# EAGLE schematic d725-pwm-dco (EAGLE 7.6.0)
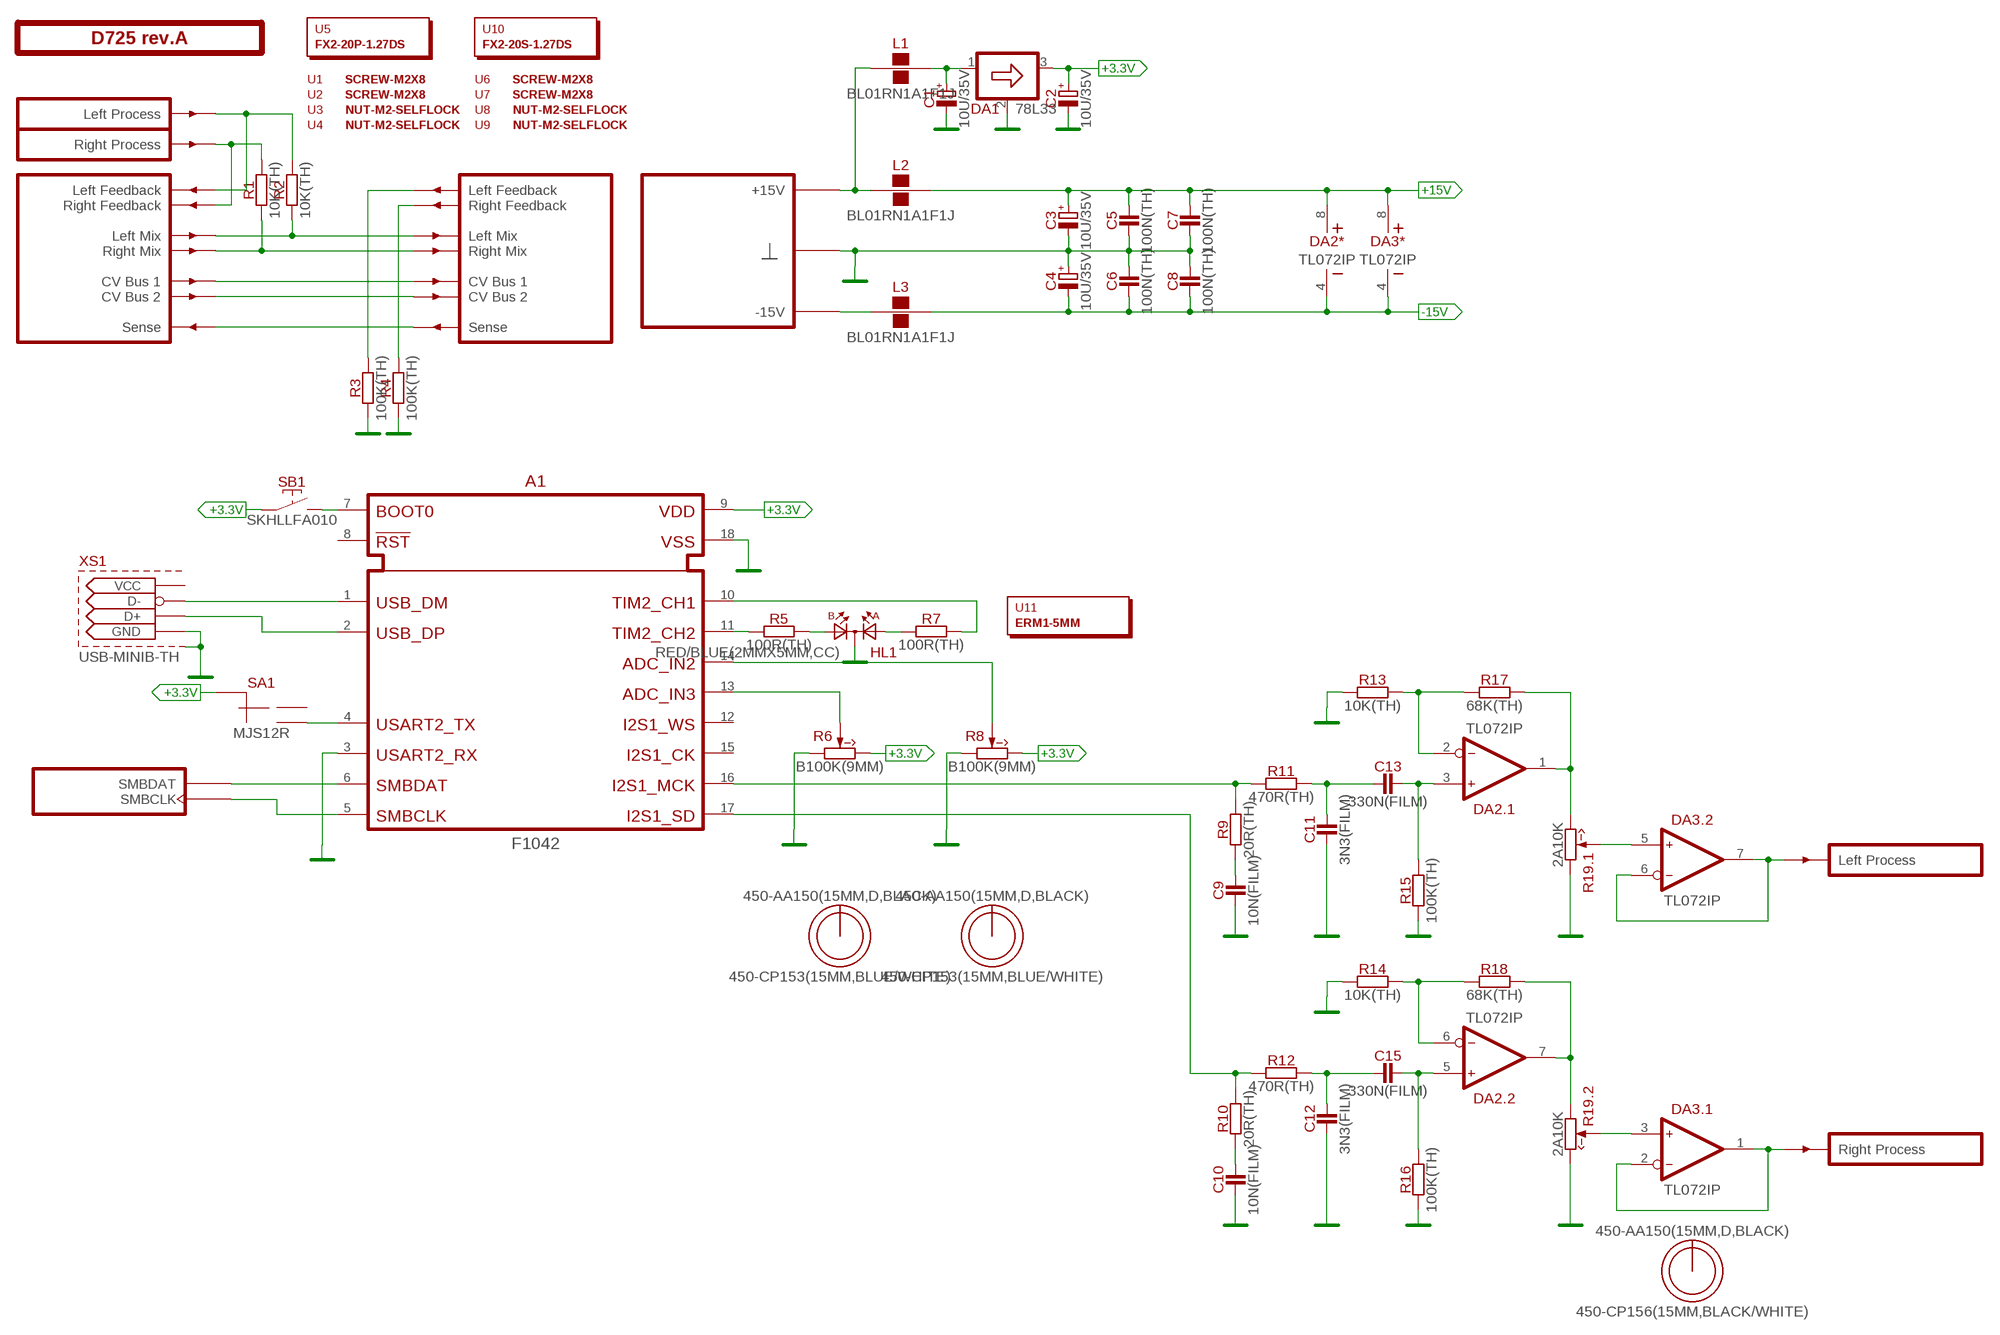
[diagram p0: schematic, sheet 1]

## Parts
A1  F1042  [F-DIP18]
C1  10U/35V  [E2-5]
C2  10U/35V  [E2-5]
C3  10U/35V  [E2-5]
C4  10U/35V  [E2-5]
C5  100N(TH)  [C050-024X044]
C6  100N(TH)  [C050-024X044]
C7  100N(TH)  [C050-024X044]
C8  100N(TH)  [C050-024X044]
C9  10N(FILM)  [C050-025X075]
C10  10N(FILM)  [C050-025X075]
C11  3N3(FILM)  [C050-025X075]
C12  3N3(FILM)  [C050-025X075]
C13  330N(FILM)  [C050-035X075]
C15  330N(FILM)  [C050-035X075]
DA1  78L33  [TO92]
DA2  TL072IP  [DIP-8]
DA3  TL072IP  [DIP-8]
HL1  RED/BLUE(2MMX5MM,CC)  [LED2X5-3PIN]
L1  BL01RN1A1F1J  [BL01RN1A]
L2  BL01RN1A1F1J  [BL01RN1A]
L3  BL01RN1A1F1J  [BL01RN1A]
O1  450-AA150(15MM,D,BLACK)  [EMPTY]
O2  450-CP153(15MM,BLUE/WHITE)  [EMPTY]
O3  450-AA150(15MM,D,BLACK)  [EMPTY]
O4  450-CP153(15MM,BLUE/WHITE)  [EMPTY]
O5  450-AA150(15MM,D,BLACK)  [EMPTY]
O6  450-CP156(15MM,BLACK/WHITE)  [EMPTY]
PCB1  D725 rev.A  ST2-BOARD-50  [ST2-BOARD-50]
R1  10K(TH)  [R-0207/10]
R2  10K(TH)  [R-0207/10]
R3  100K(TH)  [R-0207/10]
R4  100K(TH)  [R-0207/10]
R5  100R(TH)  [R-0207/10]
R6  B100K(9MM)  [RV09-SINGLE]
R7  100R(TH)  [R-0207/10]
R8  B100K(9MM)  [RV09-SINGLE]
R9  20R(TH)  [R-0207/10]
R10  20R(TH)  [R-0207/10]
R11  470R(TH)  [R-0207/10]
R12  470R(TH)  [R-0207/10]
R13  10K(TH)  [R-0207/10]
R14  10K(TH)  [R-0207/10]
R15  100K(TH)  [R-0207/10]
R16  100K(TH)  [R-0207/10]
R17  68K(TH)  [R-0207/10]
R18  68K(TH)  [R-0207/10]
R19  2A10K  [RV11-DUAL]
SA1  MJS12R  [APEM-MJS12R]
SB1  SKHLLFA010  [SKHLLFA010]
U1  SCREW-M2X8  [EMPTY]
U2  SCREW-M2X8  [EMPTY]
U3  NUT-M2-SELFLOCK  [EMPTY]
U4  NUT-M2-SELFLOCK  [EMPTY]
U5  FX2-20P-1.27DS  [EMPTY]
U6  SCREW-M2X8  [EMPTY]
U7  SCREW-M2X8  [EMPTY]
U8  NUT-M2-SELFLOCK  [EMPTY]
U9  NUT-M2-SELFLOCK  [EMPTY]
U10  FX2-20S-1.27DS  [EMPTY]
U11  ERM1-5MM  [EMPTY]
XS1  USB-MINIB-TH  [USB-MB-H]

## Nets
+3.3V: A1.9(VDD) C2.+ DA1.3(OUT) R6.3(CW) R8.3(CW) SA1.C(CM) SB1.1
+15V: C3.+ C5.2 C7.2 DA2.8(*:V+) DA3.8(*:V+) L2.2
-15V: C4.- C6.1 C8.1 DA2.4(*:V-) DA3.4(*:V-) L3.2
GND: A1.3(USART2_RX) A1.18(VSS) C1.- C2.- C3.- C4.+ C5.1 C6.2 C7.1 C8.2 C9.1 C10.1 C11.1 C12.1 DA1.2(GND) HL1.K PCB1.B4'(GND) PCB1.B4(GND) PCB1.B5'(GND) PCB1.B5(GND) PCB1.B6'(GND) PCB1.B6(GND) PCB1.B7'(GND) PCB1.B7(GND) PCB1.B8'(GND) PCB1.B8(GND) R3.1 R4.1 R6.1(CCW) R8.1(CCW) R13.1 R14.1 R15.1 R16.1 R19.1(.1:CCW) R19.3'(.2:CW) XS1.GND XS1.P$1(S1) XS1.P$2(S1) XS1.P$6(S1) XS1.P$7(S1)
LMIX: PCB1.ALMIX'(LMIX') PCB1.ALMIX(LMIX) R2.1
N$1: L1.1 L2.1 PCB1.A+15'(P+15V) PCB1.A+15(P+15V) PCB1.B+15'(P+15V) PCB1.B+15(P+15V)
N$2: PCB1.ARFBK(RFBK) PCB1.BINR(INR) R1.2
N$3: C1.+ DA1.1(IN) L1.2
N$4: PCB1.ALFBK(LFBK) PCB1.BINL(INL) R2.2
N$5: A1.11(TIM2_CH2) R5.1
N$6: A1.6(SBMDAT) PCB1.ASMBDAT'(SMBDAT) PCB1.ASMBDAT(SMBDAT)
N$7: A1.5(SMBCLK) PCB1.ASMBCLK'(SMBCLK) PCB1.ASMBCLK(SMBCLK)
N$8: A1.7(BOOT0) SB1.2
N$9: A1.1(USB_DM) XS1.D-
N$10: C9.2 R9.1
N$11: A1.16(I2S1_MCK) R9.2 R11.1
N$12: A1.2(USB_DP) XS1.D+
N$13: HL1.A2 R5.2
N$14: HL1.A1 R7.1
N$15: A1.10(TIM2_CH1) R7.2
N$16: PCB1.BSENSE'(SENSE') PCB1.BSENSE(SENSE)
N$17: PCB1.ACV1'(CV1') PCB1.ACV1(CV1)
N$18: PCB1.ARFBK'(RFBK') R4.2
N$19: A1.13(ADC_IN3) R6.2(W)
N$20: A1.14(ADC_IN2) R8.2(W)
N$21: PCB1.ALFBK'(LFBK') R3.2
N$22: PCB1.ACV2'(CV2') PCB1.ACV2(CV2)
N$23: A1.4(USART2_TX) SA1.NO
N$25: L3.1 PCB1.A-15'(P-15V) PCB1.A-15(P-15V) PCB1.B-15'(P-15V) PCB1.B-15(P-15V)
N$40: C10.2 R10.1
N$50: A1.17(I2S1_SD) R10.2 R12.1
N$52: C12.2 C15.1 R12.2
N$53: C15.2 DA2.5(.2:IN+) R16.2
N$54: C11.2 C13.1 R11.2
N$55: DA2.6(.2:IN-) R14.2 R18.1
N$56: DA2.7(.2:OUT) R18.2 R19.1'(.2:CCW)
N$57: DA3.3(.1:IN+) R19.2'(.2:W)
N$58: DA3.1(.1:OUT) DA3.2(.1:IN-) PCB1.BOUTR'(OUTR)
N$59: C13.2 DA2.3(.1:IN+) R15.2
N$60: DA2.2(.1:IN-) R13.2 R17.1
N$61: DA2.1(.1:OUT) R17.2 R19.3(.1:CW)
N$62: DA3.5(.2:IN+) R19.2(.1:W)
N$63: DA3.6(.2:IN-) DA3.7(.2:OUT) PCB1.BOUTL'(OUTL)
RMIX: PCB1.ARMIX'(RMIX') PCB1.ARMIX(RMIX) R1.1
Unconnected: A1.8(!RST) A1.12(I2S1_WS) A1.15(I2S1_CK) SA1.NC XS1.VBUS(VCC)

## Library data of the parts
A1 = module-footprints:F1042
C1-C4 = capacitors-electrolytic:?; MOUSER: 647-USW1V100MDD
C5-C8 = capacitors:?; MOUSER: 81-RCER71H104K0A2H3B
C9 C10 = capacitors:?; MOUSER: 80-F622JF103J100C
C11 C12 = capacitors:?; MOUSER: 505-FKS23300/100/10
C13 C15 = capacitors:?; MOUSER: 505-MKS2.33/63/10
DA1 = regulators-linear:78L33
DA2 DA3 = ic-ti:TL072; MOUSER: 595-TL072IP
HL1 = optoelectronics:?(2MMX5MM,CC)
L1-L3 = inductors:BL01RN1A?; MOUSER: 81-BL01RN1A1F1J
O1 O3 O5 = hardware:450-AA?; MOUSER: 450-AA150
O2 O4 = hardware:450-C?; MOUSER: 450-CP153
O6 = hardware:450-C?; MOUSER: 450-CP156
PCB1 = module-footprints:ST2-BOARD-?
R1 R2 R13 R14 = resistors:?; MOUSER: 71-RN55D-F-10K
R3 R4 R15 R16 = resistors:?; MOUSER: 71-RN55D-F-100K
R5 R7 = resistors:?; MOUSER: 71-RN55D-F-100/R
R6 R8 = potentiometers:?; MOUSER: 688-RK09D113BF25B15
R9-R12 R17 R18 = resistors:?
R19 = potentiometers:2**?; MOUSER: 688-RK12L12C0A0E
SA1 = switches:MJS12R; MOUSER: 642-MJS12R
SB1 = switches:SKHLLFA010; MOUSER: 688-SKHLLF
U1-U4 U6-U9 = hardware:*?
U5 = hardware:?; MOUSER: 798-FX2-20P-1.27DS71
U10 = hardware:?; MOUSER: 798-FX2-20S-1.27DS71
U11 = hardware:?
XS1 = connectors:USB-MINIB-TH